# EAGLE schematic rom_api (EAGLE 7.2.0)
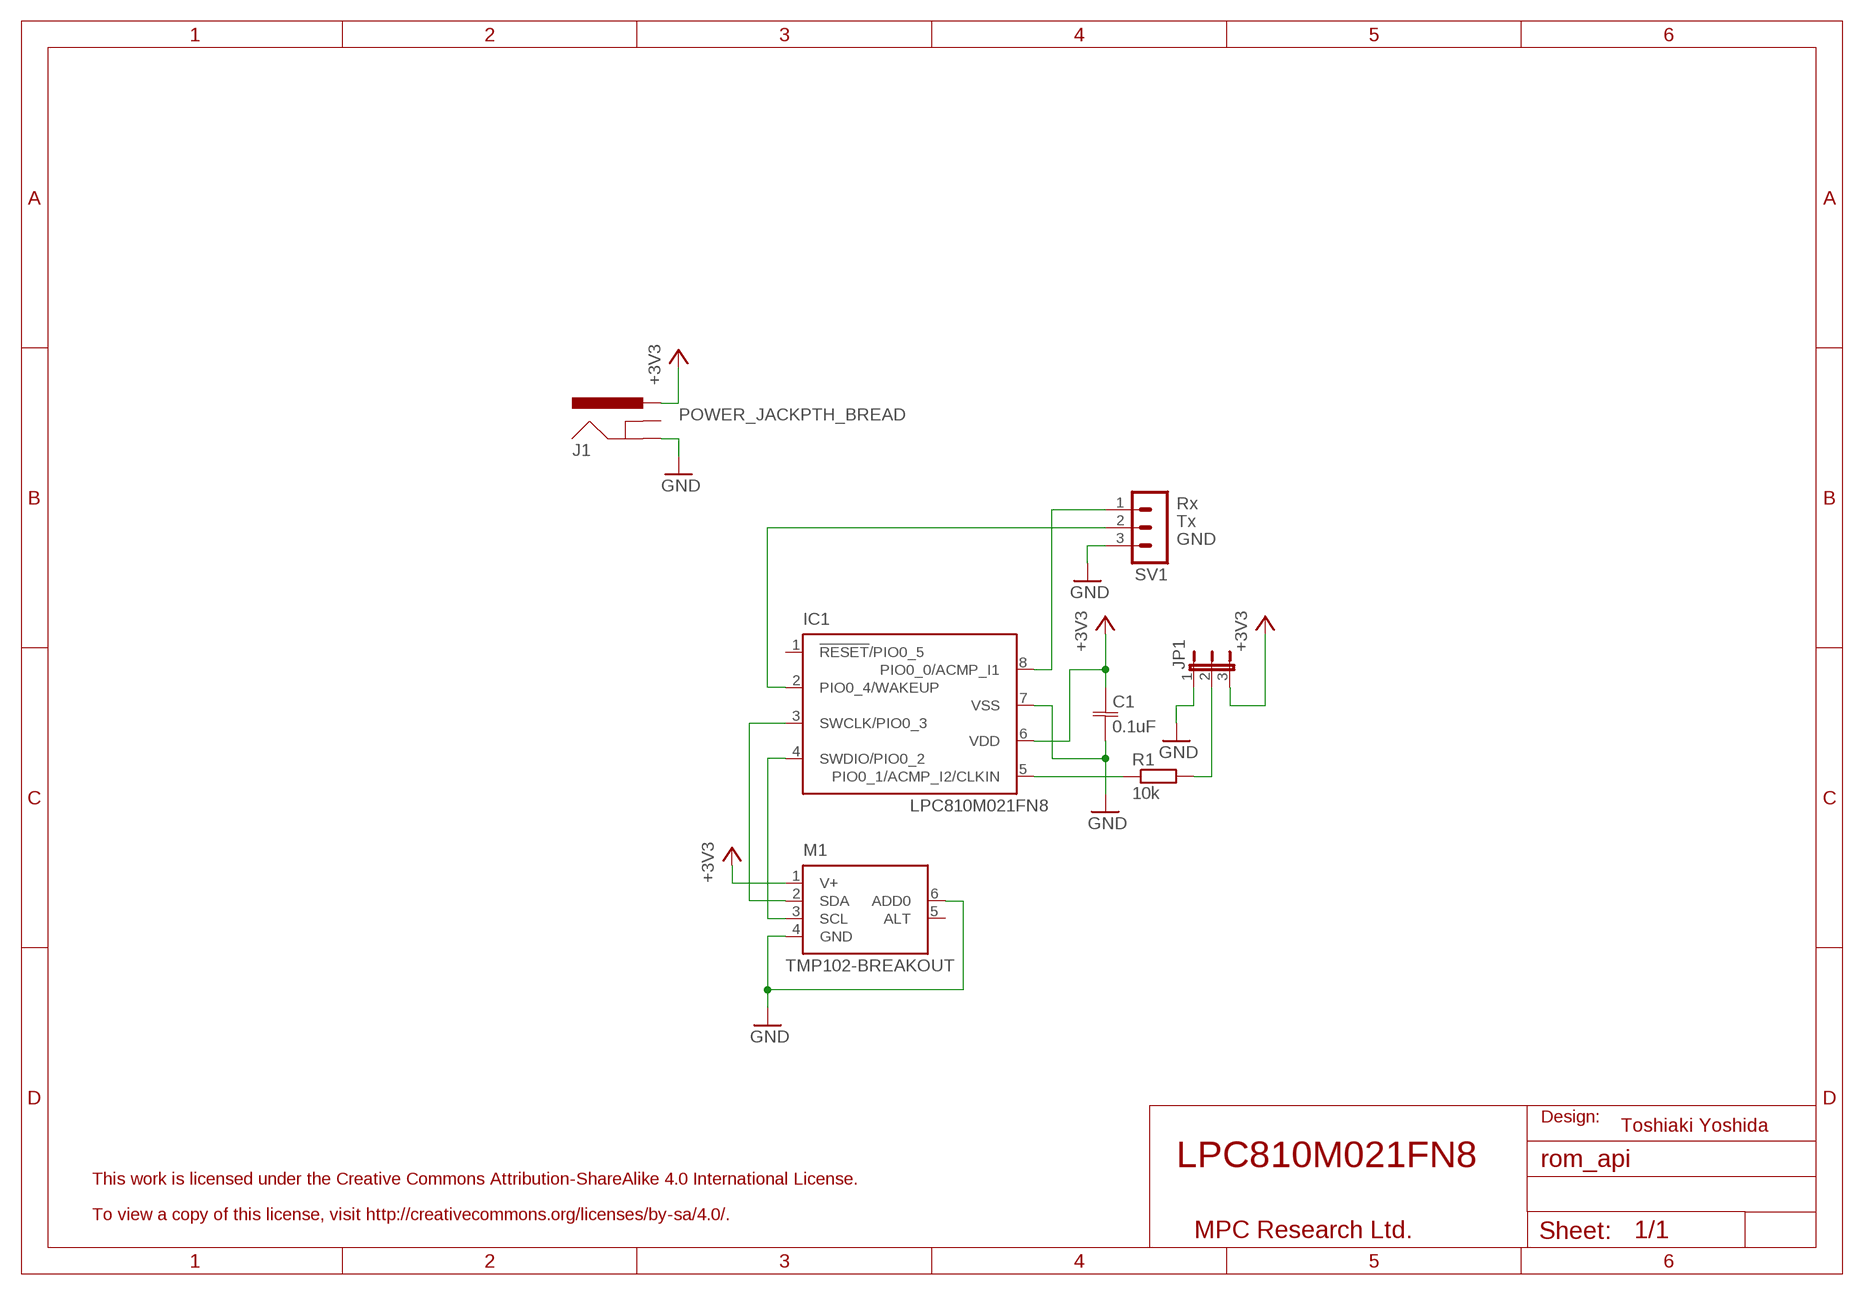
[diagram p0: schematic, sheet 1]

## Parts
C1  0.1uF  C-JIS050-024X044  [C050-024X044]
IC1  LPC810M021FN8  [DIL08]
J1  POWER_JACKPTH_BREAD  [POWER_JACK_PTH_BREAD]
JP1  JP2E  [JP2]
M1  TMP102-BREAKOUT  [TMP102-BREAKOUT]
R1  10k  R-EU_0207/10  [0207/10]
SV1  MA03-1  [MA03-1]

## Nets
+3V3: C1.1 IC1.6(VDD) J1.PWR JP1.3 M1.1(V+)
GND: C1.2 IC1.7(VSS) J1.GND JP1.1 M1.4(GND) M1.6(ADD0) SV1.3
N$1: IC1.4(SWDIO/PIO0_2) M1.3(SCL)
N$2: IC1.3(SWCLK/PIO0_3) M1.2(SDA)
N$3: IC1.5(PIO0_1/ACMP_I2/CLKIN) R1.1
N$4: JP1.2 R1.2
N$5: IC1.8(PIO0_0/ACMP_I1) SV1.1
N$6: SV1.2
Unconnected: IC1.1(!RESET!/PIO0_5) IC1.2(PIO0_4/WAKEUP) J1.GNDBREAK M1.5(ALT)

## Notes on the sheet
- Rx
- Tx
- GND
- Design:
- Toshiaki Yoshida
- LPC810M021FN8
- This work is licensed under the Creative Commons Attribution-ShareAlike 4.0 International License.
- To view a copy of this license, visit http://creativecommons.org/licenses/by-sa/4.0/.
- MPC Research Ltd.

## Library data of the parts
C1 = cap:C-JIS: CAPACITOR, Japanese symbol
IC1 = nxp:LPC810M021
J1 = SparkFun-Connectors:POWER_JACK: Power Jack This is the standard 5.5mm barrel jack for power. The PTH is the most common, proven, reliable, footprint. The Slot footprint only works if the mill layer is transmitted to the PCB fab house so be warned. Mating wall wart : TOL-00298 (and others); PROD_ID: PRT-10811
JP1 = jumper:JP2E: JUMPER
M1 = sparkfun:TMP102-BREAKOUT: Digital Temperature Sensor Breakout-TMP102 SparkFun Electronics
R1 = resistor:R-EU_: RESISTOR, European symbol
SV1 = con-lstb:MA03-1: PIN HEADER; OC_FARNELL: unknown; OC_NEWARK: unknown